# EAGLE design SparkFun_Amplified-Mic (EAGLE 7.5.0)
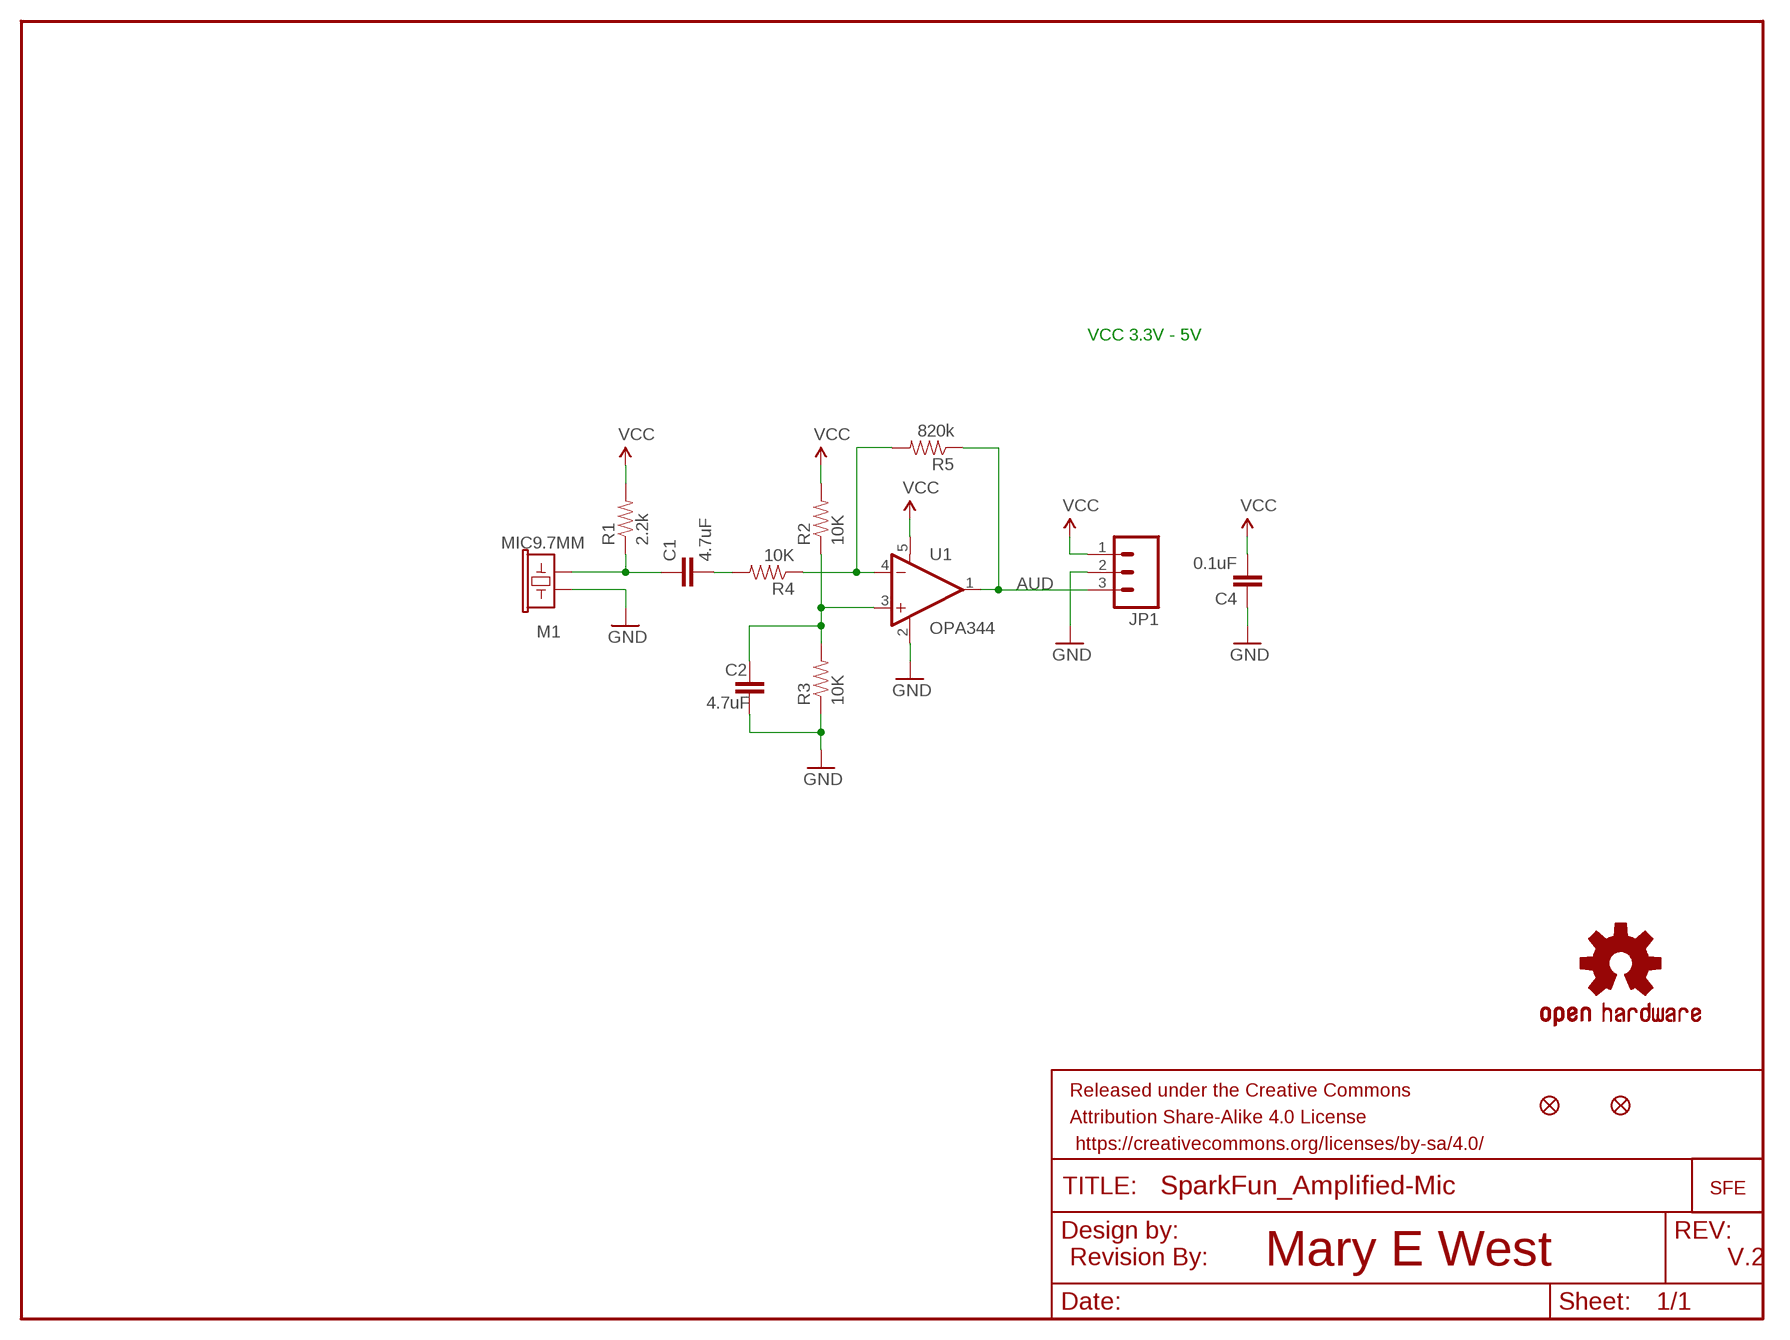
[diagram p0: schematic, sheet 1]

## Parts
C1  4.7uF  4.7UF-6.3V-10%(0603)0603  [0603-CAP]
C2  4.7uF  4.7UF-6.3V-10%(0603)0603  [0603-CAP]
C4  0.1uF  0.1UF-25V(+80/-20%)(0603)  [0603-CAP]
FRAME1  FRAME-LETTER  [CREATIVE_COMMONS]
JP1  M03PTH  [1X03]
JP2  FIDUCIALUFIDUCIAL  [MICRO-FIDUCIAL]
JP3  FIDUCIALUFIDUCIAL  [MICRO-FIDUCIAL]
LOGO1  OSHW-LOGOMINI  [OSHW-LOGO-MINI]
M1  MIC9.7MM  [MIC-9.7MM]
R1  2.2k  2.2KOHM-1/10W-1%(0603)  [0603-RES]
R2  10K  10KOHM-1/10W-1%(0603)0603  [0603-RES]
R3  10K  10KOHM-1/10W-1%(0603)0603  [0603-RES]
R4  10K  10KOHM-1/10W-1%(0603)0603  [0603-RES]
R5  820k  820KOHM-1/10W-1%(0603)  [0603-RES]
U1  OPA344  [SOT23-5]
U$1  LOGO-SFESK  [SFE-LOGO-FLAME]
U$2  REVISION  [REVISION]

## Nets
AUD: JP1.3 R5.1 U1.1(OUT)
GND: C2.2 C4.1 JP1.2 M1.2 R3.1 U1.2(V-)
N$1: C1.1 M1.1 R1.1
N$2: R4.1 R5.2 U1.4(-IN)
N$6: C1.2 R4.2
N$7: C2.1 R2.1 R3.2 U1.3(+IN)
VCC: C4.2 JP1.1 R1.2 R2.2 U1.5(V+)

## Notes on the sheet
- VCC 3.3V - 5V
- Mary E West | V.2

## Library data of the parts
C1 C2 = SparkFun-Capacitors:4.7UF-6.3V-10%(0603): CAP-08280; PROD_ID: CAP-08280
C4 = SparkFun-Capacitors:0.1UF-25V(+80/-20%)(0603): CAP-00810 Ceramic Standard decoupling cap; PROD_ID: CAP-00810
FRAME1 = SparkFun-Aesthetics:FRAME-LETTER: Schematic Frame Standard 8.5x11 US Letter frame
JP1 = SparkFun:M03: Header 3 Standard 3-pin 0.1" header. Use with straight break away headers (SKU : PRT-00116), right angle break away headers (PRT-00553), swiss pins (PRT-00743), machine pins (PRT-00117), and female headers (PRT-00115). Molex polarized connector foot print use with SKU : PRT-08232 with associated crimp pins and housings.
JP2 JP3 = SparkFun-Aesthetics:FIDUCIAL: Fiducial Alignment Points Various fiducial points for machine vision alignment.
LOGO1 = SparkFun-Aesthetics:OSHW-LOGO: Open Source Hardware Logo This logo indicates the piece of hardware it is found on incorporates a OSHW license and/or adheres to the definition of open source hardware found here: http://freedomdefined.org/OSHW
M1 = SparkFun-Sensors:MIC: Omni-directional electret microphone. 9.7mm standard diameter.; PROD_ID: COMP-08856
R1 = SparkFun-Resistors:2.2KOHM-1/10W-1%(0603): RES-08272; PROD_ID: RES-08272
R2-R4 = SparkFun-Resistors:10KOHM-1/10W-1%(0603): RES-00824; PROD_ID: RES-00824
R5 = SparkFun-Resistors:820KOHM-1/10W-1%(0603); PROD_ID: RES-13247
U1 = SparkFun-AnalogIC:OPA344: Single gate rail-to-rail output op-amp. Inputs extend 300mV past rails.
U$1 = SparkFun:LOGO-SFE: Spark Fun Electronics PCB Logo This is the standard Spark Fun Electronics PCB logo.
U$2 = SparkFun-Aesthetics:REVISION

## Board
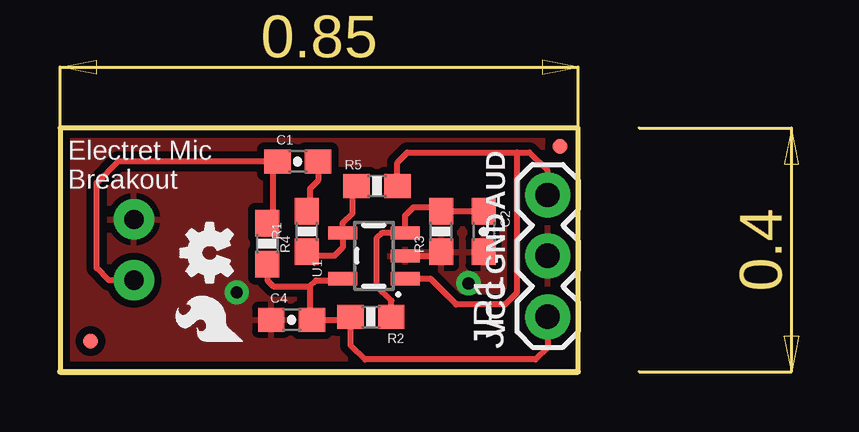
[diagram p1: board, top side]
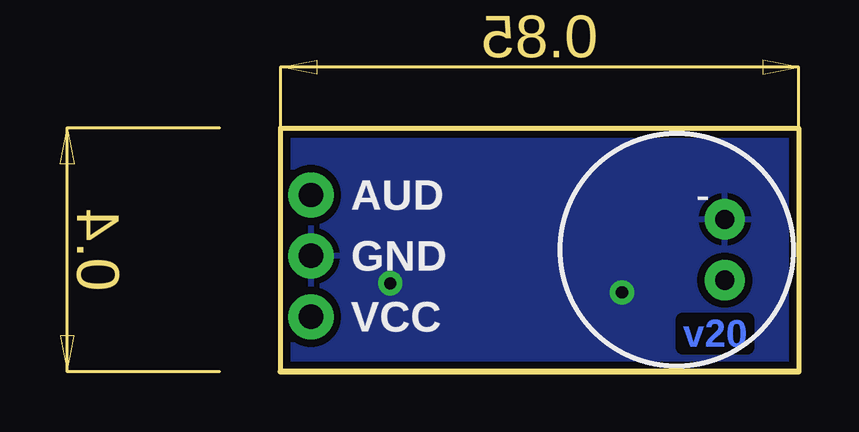
[diagram p2: board, bottom side, seen from below]

Size 21.59 x 10.16 mm. Coordinates in mm from the lower left corner, seen from the top.
Outline: 21.59,0 21.59,10.16 0,10.16 0,0 21.59,0
Copper layers (1*16): Top 0.035mm / dielectric 1.5mm / Bottom 0.035mm
Design rules "SparkFun-2-layer-STANDARD": minimum track width 10mil, minimum drill 20mil, track to track 10mil, track to pad 8mil, pad to pad 8mil, via to via 10mil, smd to smd 8mil, copper to edge 8mil, drill to drill 8mil, minimum pad ring 10mil, minimum via ring 10mil, stop-mask expansion 4mil, vias tented up to drill 20mil, thermal gap 10mil

### Footprints (pad centres in the part's own frame; a part is rotated, then mirrored left to right if it is on the bottom)
0603-CAP = smd 1.1 x 1: 1 -0.85,0; 2 0.85,0
1X03 = drill 1.016 pad 1.88: 1 0,0; 2 2.54,0; 3 5.08,0
MICRO-FIDUCIAL = smd 0.635 x 0.635: 1 0,0
MIC-9.7MM = drill 0.8 pad 1.676: 1 -2,1.27; 2 -2,-1.27
0603-RES = smd 1.1 x 1: 1 -0.85,0; 2 0.85,0
SOT23-5 = smd 0.55 x 1.2: 1 -0.95,-1.3; 2 0,-1.3; 3 0.95,-1.3; 4 0.95,1.3; 5 -0.95,1.3

### Placement (x,y rotation side)
C1  9.91,8.76 0 top
C2  17.65,5.84 270 top
C4  9.65,2.16 0 top
FRAME1  -7.39,-9.65 0 top  (outside the outline)
JP1  20.32,2.29 90 top
JP2  20.83,9.4 0 top
JP3  1.27,1.27 0 top
LOGO1  6.22,4.95 90 top
M1  5.08,5.08 180 bottom
R1  8.64,5.33 270 top
R2  12.95,2.29 180 top
R3  15.88,5.84 90 top
R4  10.29,5.84 90 top
R5  13.21,7.75 180 top
U1  13.08,4.83 90 top
U$1  7.62,1.27 90 top
U$2  -26.67,-19.05 0 top  (outside the outline)

### Tracks (layer width: path | path; a pad name or v marks a point on that pad's centre or on a via)
AUD
  Top 0.254: R5.1 14.06,8.72 14.48,9.14 19.05,9.14 | 19.05,9.14 19.56,9.14 20.32,8.38 JP1.3 | 19.05,9.14 19.05,3.3 18.54,2.79 16.51,2.79 15.43,3.88 U1.1
GND  (via drill 0.51, 0.51 pad 0.61)
  Top 0.254: U1.2 15.71,4.83 R3.1
  other vias: 17.02,3.68 7.37,3.3
  pour Bottom (isolate 0.305): 0,0 0,10.16 21.59,10.16 21.59,0
  pour Top (isolate 0.305): 0,0 0,10.16 21.59,10.16 21.59,0
N$1
  Top 0.254: R1.1 8.89,6.44 8.89,8.6 C1.1 2.41,8.76 1.52,7.87 1.52,4.32 2.03,3.81 M1.1
N$2
  Top 0.254: R5.2 12.19,7.58 12.19,6.6 11.78,6.19 U1.4 11.78,5.18 11.43,4.83 10.45,4.83 R4.1
N$6
  Top 0.254: C1.2 10.76,7.96 10.41,7.62 10.41,6.82 R4.2
N$7
  Top 0.254: R2.1 13.8,2.96 13.21,3.56 13.21,5.59 13.4,5.78 U1.3 14.38,6.51 14.73,6.86 15.71,6.86 R3.2 C2.1
VCC
  Top 0.254: 10.41,3.56 10.67,3.81 11.71,3.81 U1.5 | R1.2 8.64,3.81 8.89,3.56 10.41,3.56 | 10.41,3.56 10.41,2.25 C4.2 11.98,2.16 R2.2 12.1,1.1 12.7,0.51 19.81,0.51 20.32,1.02 JP1.1

### Text on the board
Bottom: v20
tPlace: Electret Mic / Breakout | AUD | GND | VCC
bPlace: AUD | GND | VCC
tValues: DNP | Mic on opposite side
Measures: All units inches
tDocu: Mary E West